# Altium project frida.PrjPcb
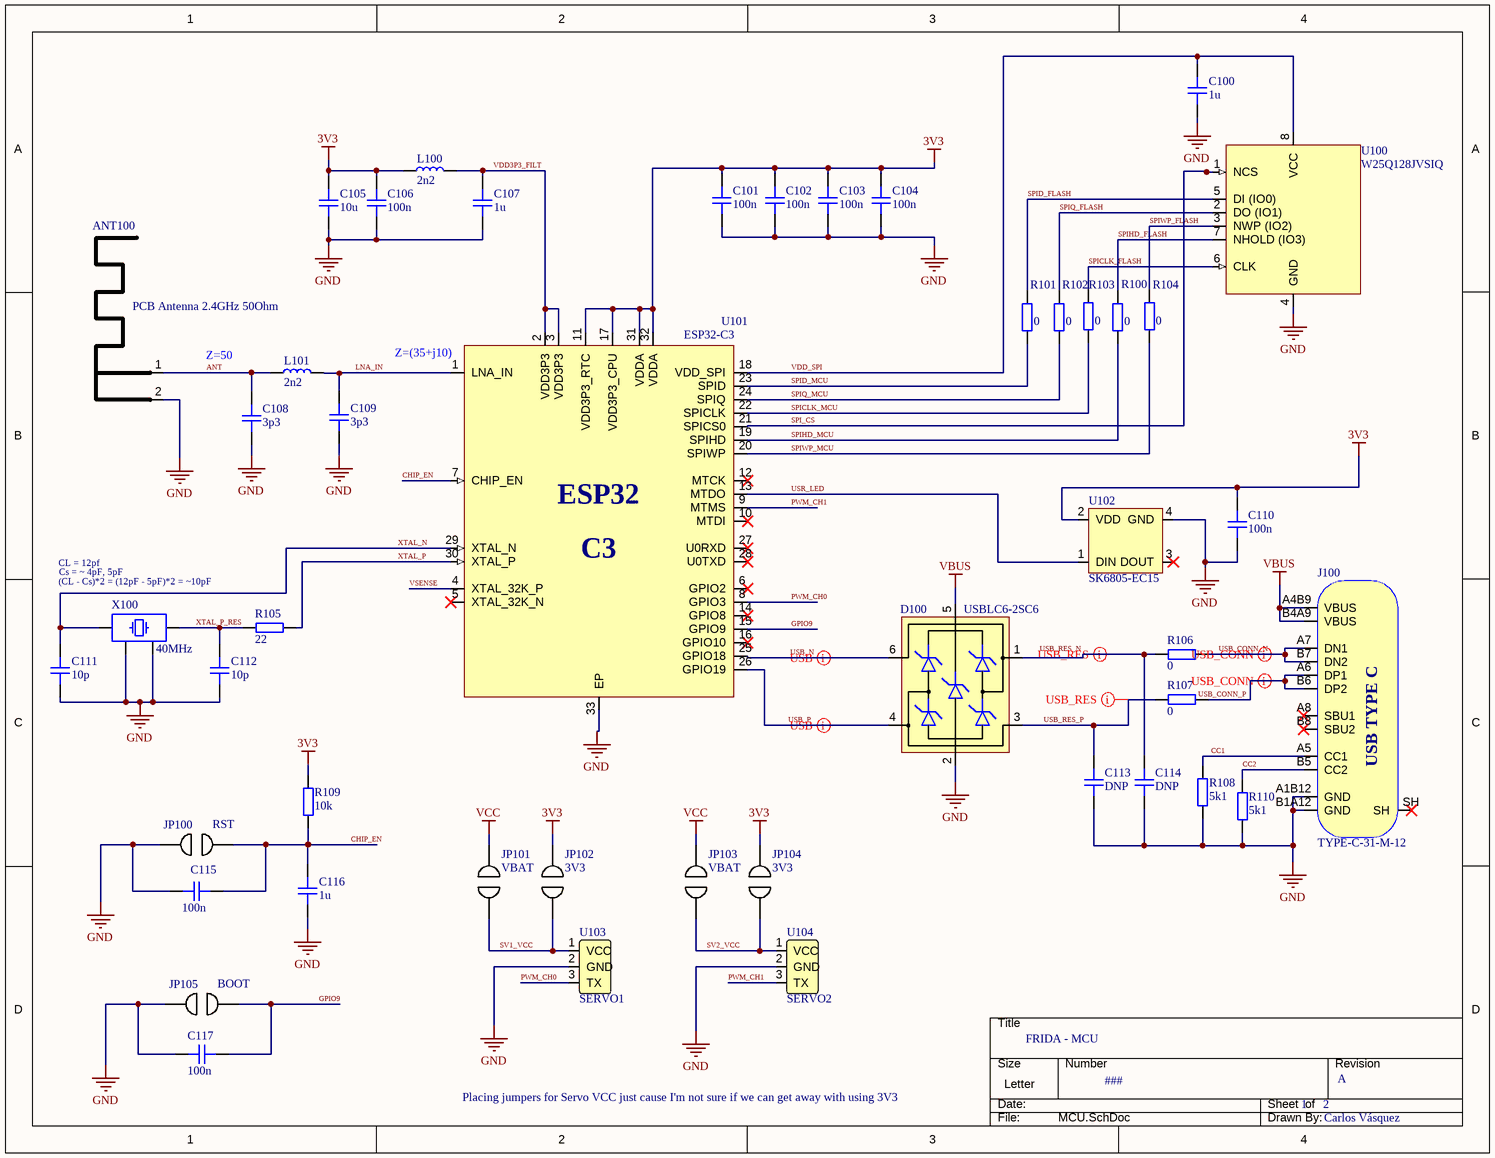
[diagram p0: MCU.SchDoc]
2 sheets, 65 parts. Net scope: global (net labels, ports and power ports of the same name join across sheets).
Board file: Frida.PcbDoc
Sheets:
  MCU.SchDoc
  Power.SchDoc

## Sheet MCU.SchDoc
size Letter; SheetNumber: 1; SheetTotal: 2

### Parts
ANT100  PCB Antenna 2.4GHz 50Ohm  [ANT_IFA_USB_2_4GHZ_50R]  (no BOM)
C100  1u  [CAP_0402]
C101  100n  [CAP_0402]
C102  100n  [CAP_0402]
C103  100n  [CAP_0402]
C104  100n  [CAP_0402]
C105  10u  [CAP_0603]
C106  100n  [CAP_0402]
C107  1u  [CAP_0402]
C108  3p3  [CAP_0402]
C109  3p3  [CAP_0402]
C110  100n  [CAP_0402]
C111  10p  [CAP_0402]
C112  10p  [CAP_0402]
C113  DNP  [CAP_0603]
C114  DNP  [CAP_0603]
C115  100n  [CAP_0402]
C116  1u  [CAP_0402]
C117  100n  [CAP_0402]
D100  USBLC6-2SC6  [SOT-23-6]
J100  TYPE-C-31-M-12  [TYPE-C-31-M-12]
JP100  RST  [SOLDER JUMPER BRIDGE]
JP101  VBAT  [SOLDER JUMPER BRIDGE]
JP102  3V3  [SOLDER JUMPER BRIDGE]
JP103  VBAT  [SOLDER JUMPER BRIDGE]
JP104  3V3  [SOLDER JUMPER BRIDGE]
JP105  BOOT  [SOLDER JUMPER BRIDGE]
L100  2n2  [IND_0402]
L101  2n2  [IND_0402]
R100  0  [RES_0402]
R101  0  [RES_0402]
R102  0  [RES_0402]
R103  0  [RES_0402]
R104  0  [RES_0402]
R105  22  [RES_0402]
R106  0  [RES_0402]
R107  0  [RES_0402]
R108  5k1  [RES_0402]
R109  10k  [RES_0402]
R110  5k1  [RES_0402]
U100  W25Q128JVSIQ  [SOIC8_208 mil]
U101  ESP32-C3  [QFN32-5x5]
U102  SK6805-EC15  [SK6805-EC15]
U103  SERVO1  [GPS UART HEADER]
U104  SERVO2  [GPS UART HEADER]
X100  40MHz  [XTAL_3225]

### Nets
3V3: C101.1 C102.1 C103.1 C104.1 C105.1 C106.1 C110.2 JP102.2 JP104.2 L100.1 R109.2 U101.11(VDD3P3_RTC) U101.17(VDD3P3_CPU) U101.31(VDDA) U101.32(VDDA) U102.2(VDD)
GND: ANT100.2(GND) C100.1 C101.2 C102.2 C103.2 C104.2 C105.2 C106.2 C107.1 C108.1 C109.1 C110.1 C111.2 C112.2 C113.1 C114.1 C115.2 C116.1 C117.2 D100.2(GND) J100.A1B12(GND) J100.B1A12(GND) JP100.1 JP105.1 R108.1 R110.1 U100.4(GND) U101.33(EP) U102.4(GND) U103.2(GND) U104.2(GND) X100.2 X100.4
VBUS: D100.5(VBUS) J100.A4B9(VBUS) J100.B4A9(VBUS)
VCC: JP101.2 JP103.2
ANT: ANT100.1(RF) C108.2 L101.1
CC1: J100.A5(CC1) R108.2
CC2: J100.B5(CC2) R110.2
CHIP_EN: C115.1 C116.2 JP100.2 R109.1 U101.7(CHIP_EN)
GPIO9: C117.1 JP105.2 U101.15(GPIO9)
LNA_IN: C109.2 L101.2 U101.1(LNA_IN)
PWM_CH0: U101.8(GPIO3) U103.3(TX)
PWM_CH1: U101.9(MTMS) U104.3(TX)
SPI_CS: U100.1(NCS) U101.21(SPICS0)
SPICLK_FLASH: R103.2 U100.6(CLK)
SPICLK_MCU: R103.1 U101.22(SPICLK)
SPID_FLASH: R101.2 U100.5(DI_(IO0))
SPID_MCU: R101.1 U101.23(SPID)
SPIHD_FLASH: R100.2 U100.7(NHOLD_(IO3))
SPIHD_MCU: R100.1 U101.19(SPIHD)
SPIQ_FLASH: R102.2 U100.2(DO_(IO1))
SPIQ_MCU: R102.1 U101.24(SPIQ)
SPIWP_FLASH: R104.2 U100.3(NWP_(IO2))
SPIWP_MCU: R104.1 U101.20(SPIWP)
SV1_VCC: JP101.1 JP102.1 U103.1(VCC)
SV2_VCC: JP103.1 JP104.1 U104.1(VCC)
USB_CONN_N: J100.A7(DN1) J100.B7(DN2) R106.2
USB_CONN_P: J100.A6(DP1) J100.B6(DP2) R107.2
USB_N: D100.6(IO1) U101.25(GPIO18)
USB_P: D100.4(IO2) U101.26(GPIO19)
USB_RES_N: C114.2 D100.1(IO1) R106.1
USB_RES_P: C113.2 D100.3(IO2) R107.1
USR_LED: U101.13(MTDO) U102.1(DIN)
VDD3P3_FILT: C107.2 L100.2 U101.2(VDD3P3) U101.3(VDD3P3)
VDD_SPI: C100.2 U100.8(VCC) U101.18(VDD_SPI)
VSENSE: U101.4(XTAL_32K_P)
XTAL_N: C111.1 U101.29(XTAL_N) X100.1
XTAL_P: R105.2 U101.30(XTAL_P)
XTAL_P_RES: C112.1 R105.1 X100.3

Not connected (* = marked no-connect by the designer): J100 A8(SBU1)* B8(SBU2)* SH*; U101 5(XTAL_32K_N)* 6(GPIO2)* 10(MTDI)* 12(MTCK)* 14(GPIO8)* 16(GPIO10)* 27(U0RXD)* 28(U0TXD)*; U102 3(DOUT)*

### Layout directives
differential pair: USB_CONN_N, USB_CONN_P, USB_N, USB_P, USB_RES_N, USB_RES_P

### Notes on the sheet
- Z=50
- (near U101) Z=(35+j10)
- CL = 12pf
- (near X100) Cs = ~ 4pF, 5pF
- (CL - Cs)*2 = (12pF - 5pF)*2 = ~10pF
- FRIDA - MCU
- Placing jumpers for Servo VCC just cause I'm not sure if we can get away with using 3V3
- ###
- 1
- 2
- A
- Carlos Vásquez
- DWG. NO.
- REV.
- SHT.
- REVISION
- DESCRIPTION
- DATE
- APPROVED
- THIS DOCUMENT AND THE DATA DISCLOSED HEREIN OR HEREWITH IS THE PROPERTY OF ALTIUM LIMITED AND MAY BE FREELY DISTRIBUTED IN WHOLE. NO RIGHTS ARE RESERVED OR EXPRESS OR IMPLIED WARANTEE GIVEN.
- ENG:
- DSN:
- APPROVALS
- PROJECT
- DOCUMENT REVISION:
- DESIGN ITEM:
- CHK:
- BOM:
- REFERENCE DOCUMENTS
- PROJECT REVISION:
- TITLE
- FAB DWG:
- PCB DWG:
- ASSY DWG:
- SCALE:
- SIZE
- C
- CAGE CODE
- FILE NAME
- DWG NO.
- SHEET
- OF
- REV
- (in symbol ESP32-C3) ESP32; C3
- (in symbol TYPE-C-31-M-12) USB TYPE C

### Library data of the parts
ANT100 = ANT_IFA_USB_2_4GHZ_50R: Inverted F 2.4GHz ISM PCB Antenna 50 Ohm; ComponentLink1Description: Datasheet; ComponentLink1URL: https://www.ti.com/lit/an/swra117d/swra117d.pdf
C100-C104 C106-C112 C115-C117 = CAP_0402: Capacitor SMD 0402; Manufacturer: *; Manufacturer Part Number: *; Distributor Link: *; LCSC: *; Rating: *; Dielectric: *
C105 C113 C114 = CAP_0603: Capacitor SMD 0603; Manufacturer: *; Manufacturer Part Number: *; Distributor Link: *; LCSC: *; Rating: *; Dielectric: *
D100 = USBLC6-2SC6: Low-Capacitance ESD Protection USB; Manufacturer: STMicroelectronics; Manufacturer Part Number: USBLC6-2SC6; Distributor Link: https://www.mouser.de/ProductDetail/STMicroelectronics/USBLC6-2SC6?qs=po45yt2pPpu%2FhNIlwQdTlg%3D%3D
J100 = TYPE-C-31-M-12: USB Type C Connector Horizontal SMT; Manufacturer: Koren Hroparts; Manufacturer Part Number: TYPE-C-31-M-12
JP100-JP105 = SOLDER BRIDGE: Solder Jumper Bridge
L100 L101 = IND_0402: Inductor SMD 0402
R100-R110 = RES_0402: Resistor SMD 0402; Manufacturer: *; Manufacturer Part Number: *; Distributor Link: *; LCSC: *
U100 = W25Q128JVSIQ: 128M-BIT / SERIAL FLASH MEMORY WITH / DUAL/QUAD SPI & QPI & DTR SOIC-8 208 MIL; Manufacturer: Winbond; Manufacturer Part Number: W25Q128JVSIM
U101 = ESP32-C3: Ultra­Low­Power SoC with RISC­V Single­Core CPU Supporting IEEE 802.11b/g/n (2.4 GHz Wi­Fi) and Bluetooth® 5 (LE); Manufacturer: Espressif; Manufacturer Part Number: ESP32-C3; LCSC: C2838500
U103 U104 = UART GPS: UART GPS (3 pin breakout)
X100 = TSX-3225_24.0000MF15X-AC: Crystal SMD 40MHz 10PPM 12pF 3225; Manufacturer: Epson; Manufacturer Part Number: TSX-3225 24.0000MF15X-AC

## Sheet Power.SchDoc
size Letter; SheetNumber: 2; SheetTotal: 2
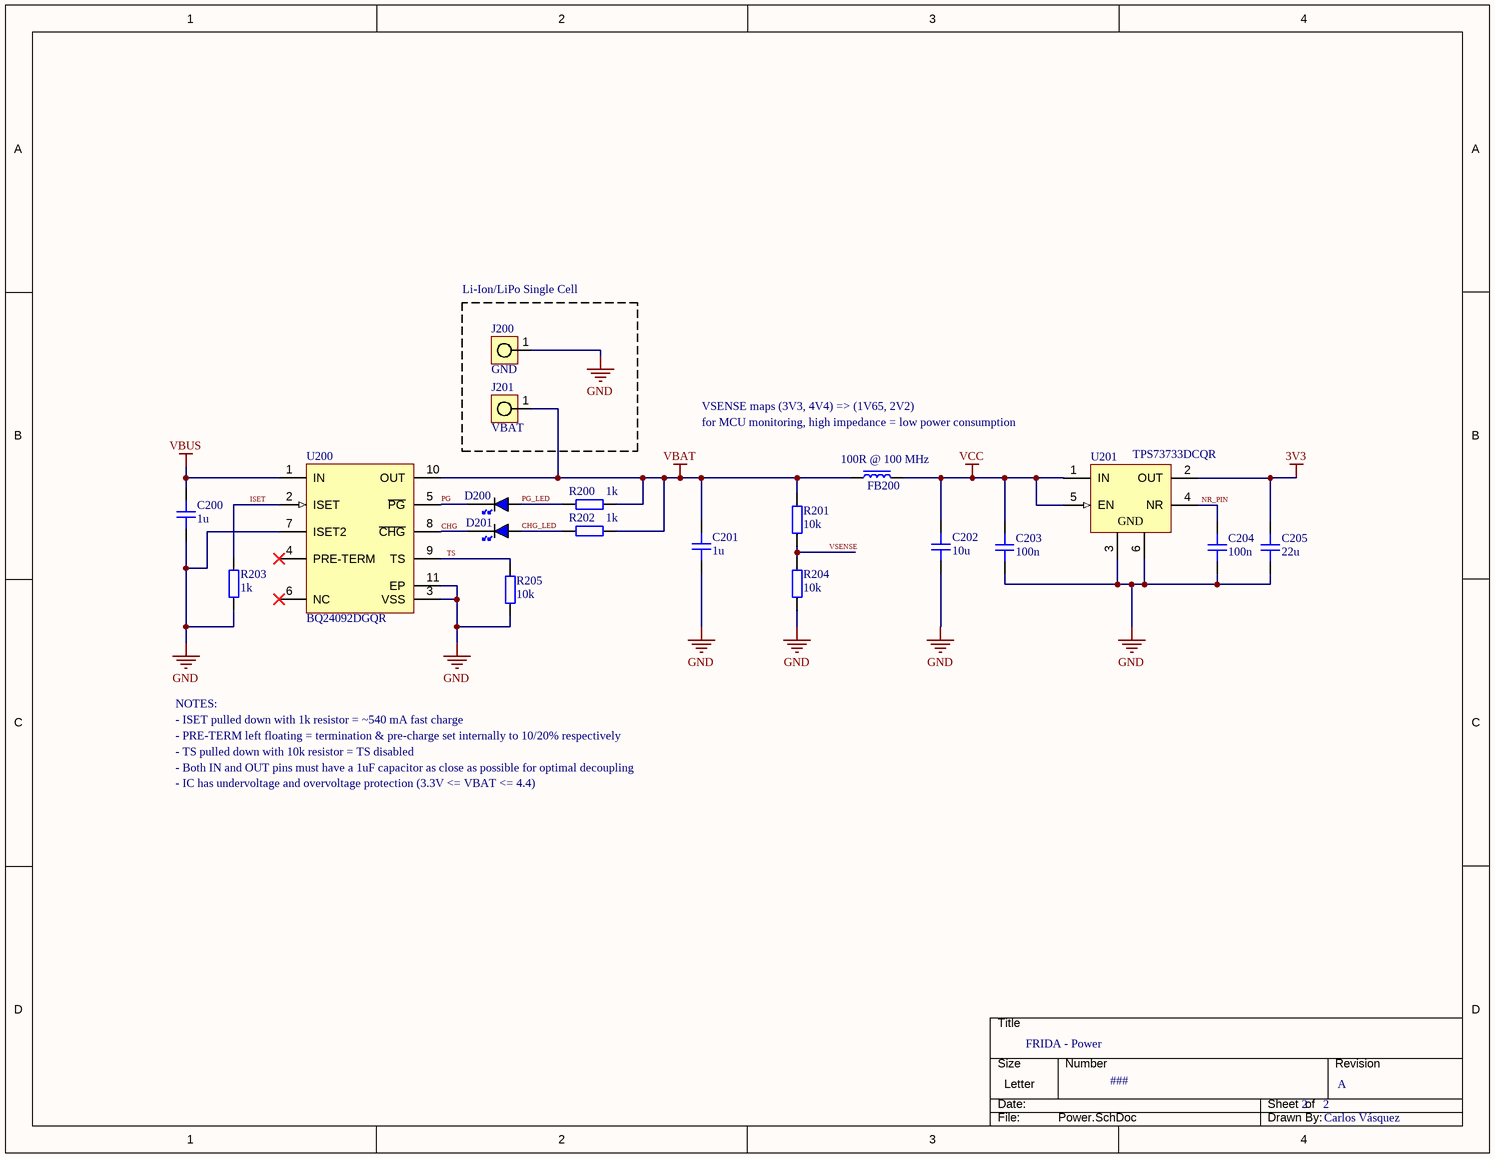
[diagram p1: Power.SchDoc]

### Parts
C200  1u  [CAP_0402]
C201  1u  [CAP_0402]
C202  10u  [CAP_0805]
C203  100n  [CAP_0603]
C204  100n  [CAP_0603]
C205  22u  [CAP_0603]
D200  BLUE  [LED_0805_BLUE]  (value not drawn)
D201  BLUE  [LED_0805_BLUE]  (value not drawn)
FB200  100R @ 100 MHz  [FB_0805]
J200  GND  [SOLDER_PIN_THT_1_5]
J201  VBAT  [SOLDER_PIN_THT_1_5]
R200  1k  [RES_0402]
R201  10k  [RES_0402]
R202  1k  [RES_0402]
R203  1k  [RES_0402]
R204  10k  [RES_0402]
R205  10k  [RES_0402]
U200  BQ24092DGQR  [DGQ0010D_L]
U201  TPS73733DCQR  [DCQ0006A_N]

### Blocks framed on the sheet
Li-Ion/LiPo Single Cell: J200 J201

### Nets
3V3: C205.2 U201.2(OUT)
GND: C200.1 C201.1 C202.1 C203.1 C204.1 C205.1 J200.1 R203.2 R204.1 R205.1 U200.3(VSS) U200.7(ISET2) U200.11(EP) U201.3(GND) U201.6(GND)
VBAT: C201.2 FB200.1 J201.1 R200.1 R201.2 R202.1 U200.10(OUT)
VBUS: C200.2 U200.1(IN)
VCC: C202.2 C203.2 FB200.2 U201.1(IN) U201.5(EN)
CHG: D201.K U200.8(~{CHG})
CHG_LED: D201.A R202.2
ISET: R203.1 U200.2(ISET)
NR_PIN: C204.2 U201.4(NR)
PG: D200.K U200.5(~{PG})
PG_LED: D200.A R200.2
TS: R205.2 U200.9(TS)
VSENSE: R201.1 R204.2

Not connected (* = marked no-connect by the designer): U200 4(PRE-TERM)* 6(NC)*

### Notes on the sheet
- VSENSE maps (3V3, 4V4) => (1V65, 2V2)
- for MCU monitoring, high impedance = low power consumption
- NOTES:
- - ISET pulled down with 1k resistor = ~540 mA fast charge
- - PRE-TERM left floating = termination & pre-charge set internally to 10/20% respectively
- - TS pulled down with 10k resistor = TS disabled
- - Both IN and OUT pins must have a 1uF capacitor as close as possible for optimal decoupling
- - IC has undervoltage and overvoltage protection (3.3V <= VBAT <= 4.4)
- FRIDA - Power
- ###
- 2
- A
- Carlos Vásquez
- DWG. NO.
- REV.
- SHT.
- REVISION
- DESCRIPTION
- DATE
- APPROVED
- THIS DOCUMENT AND THE DATA DISCLOSED HEREIN OR HEREWITH IS THE PROPERTY OF ALTIUM LIMITED AND MAY BE FREELY DISTRIBUTED IN WHOLE. NO RIGHTS ARE RESERVED OR EXPRESS OR IMPLIED WARANTEE GIVEN.
- ENG:
- DSN:
- APPROVALS
- PROJECT
- DOCUMENT REVISION:
- DESIGN ITEM:
- CHK:
- BOM:
- REFERENCE DOCUMENTS
- PROJECT REVISION:
- TITLE
- FAB DWG:
- PCB DWG:
- ASSY DWG:
- SCALE:
- SIZE
- C
- CAGE CODE
- FILE NAME
- DWG NO.
- SHEET
- OF
- REV

### Library data of the parts
C200 C201 = CAP_0402: Capacitor SMD 0402; Manufacturer: *; Manufacturer Part Number: *; Distributor Link: *; LCSC: *; Rating: *; Dielectric: *
C202 = CAP_0805: Capacitor SMD 0805; Manufacturer: *; Manufacturer Part Number: *; Distributor Link: *; LCSC: *; Rating: *; Dielectric: *
C203-C205 = CAP_0603: Capacitor SMD 0603; Manufacturer: *; Manufacturer Part Number: *; Distributor Link: *; LCSC: *; Rating: *; Dielectric: *
D200 D201 = LED_0805_BLUE: LED 0805 BLUE SMD; Manufacturer: *; Manufacturer Part Number: *; Distributor Link: *; LCSC: *
FB200 = FB_0805: Ferrite Bead SMD 0805; Manufacturer: *; Manufacturer Part Number: *; Distributor Link: *; LCSC: *
J200 J201 = SOLDER_PIN_THT: Solder Pin 1.5mm Through-Hole
R200-R205 = RES_0402: Resistor SMD 0402; Manufacturer: *; Manufacturer Part Number: *; Distributor Link: *; LCSC: *
U200 = CMP-0321-00900-2: 1 A, Single-Input, Single-Cell Li-Ion Battery Charger with Operation Over JEITA and 10 k ohm NTC, 4.5 V, -40 to 150 degC, 10-pin MSOP-PowerPAD (DGQ), Green (RoHS & no Sb/Br); Manufacturer: Texas Instruments; Li-Ion: N; SubFamily: Battery Charge Management; Vin(Min)(V): 4.5; PackageReference: DGQ0010D; Code_JEDEC: MO-187-BA-T; PackageDescription: 10-Pin PowerPAD Plastic Small Outline 0.5 mm Pitch, Exposed Pad; Lead Acid: N; ComponentLink1URL: http://www.ti.com/general/docs/lit/getliterature.tsp?genericPartNumber=BQ24092&fileType=pdf; PartNumber: BQ24092DGQR; PackageVersion: revF, Nov-2011; Li-Polymer: N; NiMH: N; NiCd: N; Eco-Plan: Green (RoHS & no Sb/Br); Over Voltage Protection: N; DatasheetVersion: SLUS968C; ComponentLink1Description: Datasheet; Mounting Technology: Surface Mount
U201 = CMP-0395-00300-2: Single Output LDO, 1 A, Fixed 3.3 V Output, 2.2 to 5.5 V Input, with Reverse Current Protection, 6-pin SOT-223 (DCQ), -40 to 125 degC, Green (RoHS & no Sb/Br); Manufacturer: Texas Instruments; Fixed Output Options(V): 3.3; Vdo(Typ)(mV): 130; Iout(Max)(A): 1; Accuracy(%): 3; SubFamily: Single Channel LDO; Vin(Min)(V): 2.2; Vin(Max)(V): 5.5; Rating: Catalog; Iq(Typ)(mA): 0.3; PartNumber: TPS73733DCQR; DatasheetVersion: SBVS067O; PackageReference: DCQ0006A; ComponentLink3URL: http://www.ti.com/litv/pdf/mpds098c; ComponentLink2Description: Datasheet; PackageDescription: 6-Pin Plastic Small Outline, Body 3.5 x 6.5 mm, Pitch 1.27 mm; ComponentLink2URL: http://www.ti.com/general/docs/lit/getliterature.tsp?genericPartNumber=TPS73733&fileType=pdf; PackageVersion: 4202109/D; Vout Adj(Min)(V): 3.3; Vout Adj(Max)(V): 3.3; Eco-Plan: Green (RoHS & no Sb/Br); ComponentLink3Description: Package Specification; Mounting Technology: Surface Mount; ComponentLink1URL: http://www.ti.com/; ComponentLink1Description: Manufacturer URL

## Nets that join several sheets
3V3: MCU (16 pins), Power (C205.2 U201.2)
GND: MCU (33 pins), Power (15 pins)
VBUS: MCU (D100.5 J100.A4B9 J100.B4A9), Power (C200.2 U200.1)
VCC: MCU (JP101.2 JP103.2), Power (5 pins)
VSENSE: MCU (U101.4), Power (R201.1 R204.2)